# Altium schematic sheet MAZ000164 - Diagrama eléctrico.SchDoc: MAZ000164 - Diagrama eléctrico
size A; ApprovedBy: Christian Ledwidth; CheckedBy: Nahuel Martinez; Author: Santiago Marti; CompanyName: Body Health; DrawnBy: Santiago Marti; Revision: A; SheetNumber: 1; SheetTotal: 2
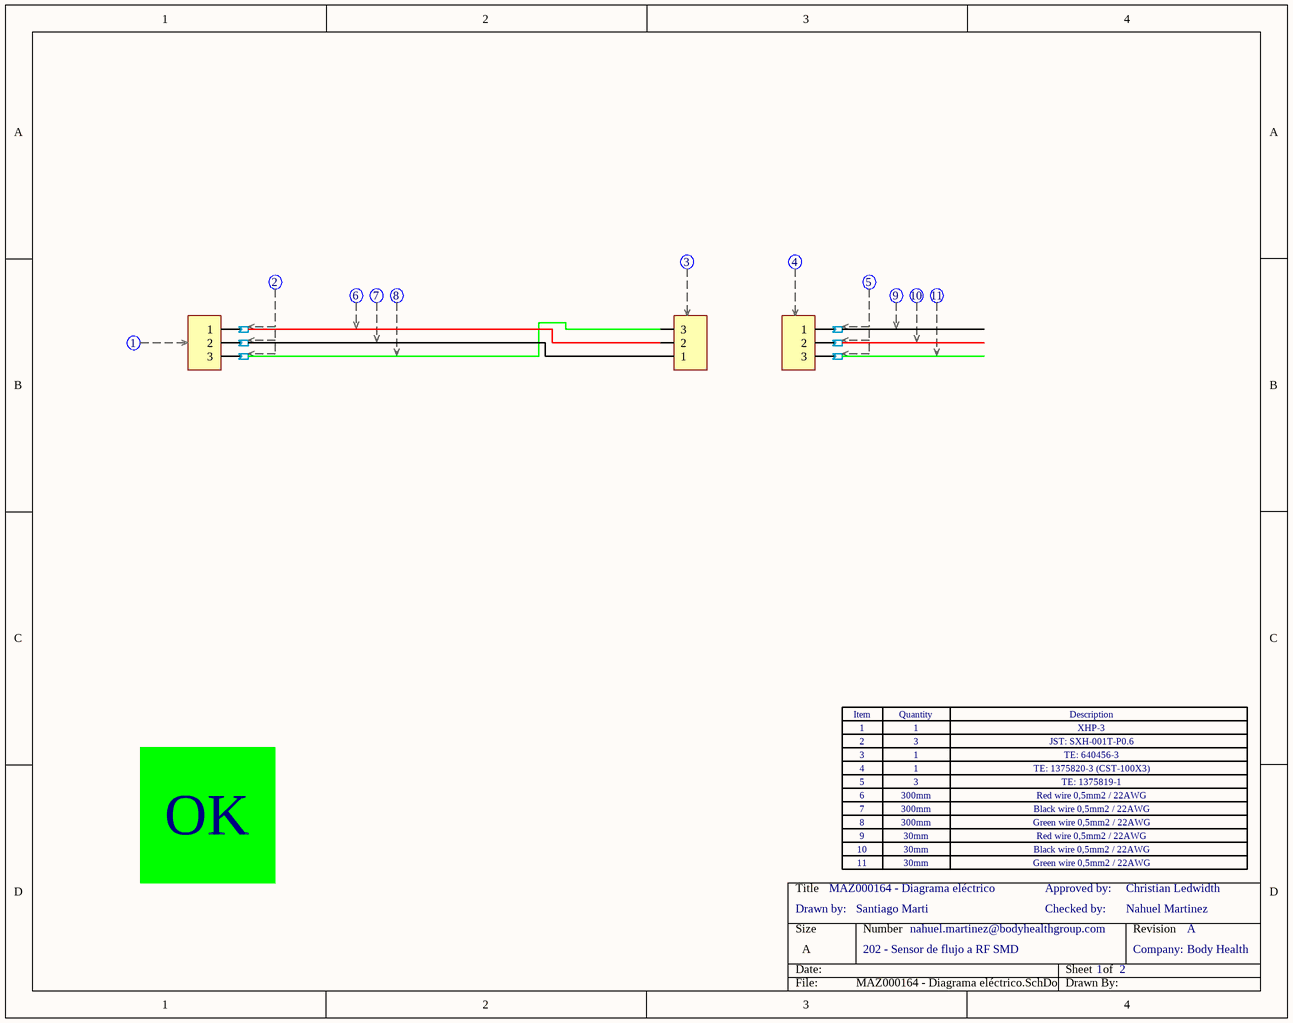
[diagram p0: MAZ000164 - Diagrama eléctrico.SchDoc]

## Parts
(Parts that share a designator on the sheet are numbered #1, #2 ... from top to bottom, then left to right.)
Con1  XHP-3  (value not drawn)  (parts C,D of 4)
Con?#1  XHP-3  (value not drawn)  (part C of 4)
Con?#2  XHP-3  (value not drawn)  (part C of 4)
Con?#3  CST-100-3  (value not drawn)  (part D of 4)
Con?#4  CST-100-3  (value not drawn)  (part D of 4)
Soc1  sock_XHP_SXH-002T-P0.6  (value not drawn)  (parts A,B of 2)
Soc2  sock_XHP_SXH-002T-P0.6  (value not drawn)  (parts A,B of 2)
Soc3  sock_XHP_SXH-002T-P0.6  (value not drawn)  (parts A,B of 2)
Soc4  sock_XHP_SXH-002T-P0.6  (value not drawn)  (part A of 2)
Soc?#1  sock_XHP_SXH-002T-P0.6  (value not drawn)  (part A of 2)
Soc?#2  sock_XHP_SXH-002T-P0.6  (value not drawn)  (part A of 2)
Soc?#3  sock_XHP_SXH-002T-P0.6  (value not drawn)  (part A of 2)
Soc?#4  sock_XHP_SXH-002T-P0.6  (value not drawn)  (part A of 2)
Soc?#5  sock_XHP_SXH-002T-P0.6  (value not drawn)  (part B of 2)
Soc?#6  sock_XHP_SXH-002T-P0.6  (value not drawn)  (part B of 2)
Soc?#7  sock_XHP_SXH-002T-P0.6  (value not drawn)  (part B of 2)
Zoc1  Zócalo_Header  (value not drawn)
Zoc2  Zócalo_Item  (value not drawn)
Zoc3  Zócalo_Item  (value not drawn)
Zoc4  Zócalo_Item  (value not drawn)
Zoc5  Zócalo_Item  (value not drawn)
Zoc6  Zócalo_Item  (value not drawn)
Zoc?#1  Zócalo_Item  (value not drawn)
Zoc?#2  Zócalo_Item  (value not drawn)
Zoc?#3  Zócalo_Item  (value not drawn)
Zoc?#4  Zócalo_Item  (value not drawn)
Zoc?#5  Zócalo_Item  (value not drawn)
Zoc?#6  Zócalo_Item  (value not drawn)

## Nets
NetCon1_1: Con1.1 Soc1.0
NetCon1_2: Con1.2 Soc2.0
NetCon1_3: Con1.3 Soc3.0
NetCon?#3_1: Con?#3.1 Soc2.1
NetCon?#3_2: Con?#3.2 Soc1.1
NetCon?#3_3: Con?#3.3 Soc3.1
NetCon?#4_1: Con?#4.1 Soc?#5.0
NetCon?#4_2: Con?#4.2 Soc?#6.0
NetCon?#4_3: Con?#4.3 Soc?#7.0

Not connected (* = marked no-connect by the designer): Soc?#5 1; Soc?#6 1; Soc?#7 1

## Notes on the sheet
- 1
- 2
- 3
- (near Zoc?#1) 4
- (near Zoc?#2) 5
- XHP-3
- JST: SXH-001T-P0.6
- TE: 640456-3
- TE: 1375820-3 (CST-100X3)
- TE: 1375819-1
- OK
- 6
- 7
- 8
- 9
- 300mm
- 30mm
- Red wire 0,5mm2 / 22AWG
- Black wire 0,5mm2 / 22AWG
- Green wire 0,5mm2 / 22AWG
- (near Zoc?#6) Drawn by:
- (near Zoc?#4) 10
- (near Zoc?#5) 11
- Checked by:
- Approved by:
- 202 - Sensor de flujo a RF SMD
- nahuel.martinez@bodyhealthgroup.com
- Company:
- (in symbol Zócalo_Header) Item; Quantity; Description

## Library data of the parts
Con1 = XHP-3: CONN HOUSING 2.5MM 3POS; Fabricante: JST Sales America Inc.; CallOut: 1; Cod.DigiKey: 455-2219-ND; Cod.Fabricante: XHP-3; ComponentLink1Description: Manufacturer Link; ComponentLink1URL: http://www.jst-mfg.com/product/pdf/eng/eXH.pdf; DIGIKEYx50: 0.06220; DIGIKEYx100: NO
Con?#1 = XHP-3: CONN HOUSING 2.5MM 3POS; Fabricante: JST Sales America Inc.; CallOut: 3; Cod.DigiKey: 455-2219-ND; Cod.Fabricante: XHP-3; ComponentLink1Description: Manufacturer Link; ComponentLink1URL: http://www.jst-mfg.com/product/pdf/eng/eXH.pdf; DIGIKEYx50: 0.06220; DIGIKEYx100: NO
Con?#2 = XHP-3: CONN HOUSING 2.5MM 3POS; Fabricante: JST Sales America Inc.; CallOut: 4; Cod.DigiKey: 455-2219-ND; Cod.Fabricante: XHP-3; ComponentLink1Description: Manufacturer Link; ComponentLink1URL: http://www.jst-mfg.com/product/pdf/eng/eXH.pdf; DIGIKEYx50: 0.06220; DIGIKEYx100: NO
Con?#3 Con?#4 = CST-100-3: CONN RCPT HSNG 3POS CST-100 II; Cod.Fabricante: 1375820-3; Fabricante: TE Connectivity AMP Connectors; Cod.DigiKey: A99614-ND; ComponentLink1Description: Manufacturer Link; ComponentLink1URL: https://www.te.com/commerce/DocumentDelivery/DDEController?Action=srchrtrv&DocNm=1375820&DocType=Customer+Drawing&DocLang=English; DIGIKEYx50: 0.12620; CallOut: *; DIGIKEYx100: 0.11720
Soc1 = sock_XHP_SXH-002T-P0.6: CONN SOCKET 26-30AWG CRIMP TIN; Fabricante: JST Sales America Inc.; CallOut: 2; Cod.DigiKey: 455-2261-1-ND; Cod.Fabricante: SXH-002T-P0.6; ComponentLink1Description: Manufacturer Link; ComponentLink1URL: http://www.jst-mfg.com/product/pdf/eng/eXH.pdf; DIGIKEYx100: 0.03300; DIGIKEYx50: 0.03420
Soc2 = sock_XHP_SXH-002T-P0.6: CONN SOCKET 26-30AWG CRIMP TIN; Fabricante: JST Sales America Inc.; CallOut: 6; Cod.DigiKey: 455-2261-1-ND; Cod.Fabricante: SXH-002T-P0.6; ComponentLink1Description: Manufacturer Link; ComponentLink1URL: http://www.jst-mfg.com/product/pdf/eng/eXH.pdf; DIGIKEYx100: 0.03300; DIGIKEYx50: 0.03420
Soc3 = sock_XHP_SXH-002T-P0.6: CONN SOCKET 26-30AWG CRIMP TIN; Fabricante: JST Sales America Inc.; CallOut: 7; Cod.DigiKey: 455-2261-1-ND; Cod.Fabricante: SXH-002T-P0.6; ComponentLink1Description: Manufacturer Link; ComponentLink1URL: http://www.jst-mfg.com/product/pdf/eng/eXH.pdf; DIGIKEYx100: 0.03300; DIGIKEYx50: 0.03420
Soc4 = sock_XHP_SXH-002T-P0.6: CONN SOCKET 26-30AWG CRIMP TIN; Fabricante: JST Sales America Inc.; CallOut: 8; Cod.DigiKey: 455-2261-1-ND; Cod.Fabricante: SXH-002T-P0.6; ComponentLink1Description: Manufacturer Link; ComponentLink1URL: http://www.jst-mfg.com/product/pdf/eng/eXH.pdf; DIGIKEYx100: 0.03300; DIGIKEYx50: 0.03420
Soc?#1 = sock_XHP_SXH-002T-P0.6: CONN SOCKET 26-30AWG CRIMP TIN; Fabricante: JST Sales America Inc.; CallOut: 5; Cod.DigiKey: 455-2261-1-ND; Cod.Fabricante: SXH-002T-P0.6; ComponentLink1Description: Manufacturer Link; ComponentLink1URL: http://www.jst-mfg.com/product/pdf/eng/eXH.pdf; DIGIKEYx100: 0.03300; DIGIKEYx50: 0.03420
Soc?#2 = sock_XHP_SXH-002T-P0.6: CONN SOCKET 26-30AWG CRIMP TIN; Fabricante: JST Sales America Inc.; CallOut: 9; Cod.DigiKey: 455-2261-1-ND; Cod.Fabricante: SXH-002T-P0.6; ComponentLink1Description: Manufacturer Link; ComponentLink1URL: http://www.jst-mfg.com/product/pdf/eng/eXH.pdf; DIGIKEYx100: 0.03300; DIGIKEYx50: 0.03420
Soc?#3 = sock_XHP_SXH-002T-P0.6: CONN SOCKET 26-30AWG CRIMP TIN; Fabricante: JST Sales America Inc.; CallOut: 10; Cod.DigiKey: 455-2261-1-ND; Cod.Fabricante: SXH-002T-P0.6; ComponentLink1Description: Manufacturer Link; ComponentLink1URL: http://www.jst-mfg.com/product/pdf/eng/eXH.pdf; DIGIKEYx100: 0.03300; DIGIKEYx50: 0.03420
Soc?#4 = sock_XHP_SXH-002T-P0.6: CONN SOCKET 26-30AWG CRIMP TIN; Fabricante: JST Sales America Inc.; CallOut: 11; Cod.DigiKey: 455-2261-1-ND; Cod.Fabricante: SXH-002T-P0.6; ComponentLink1Description: Manufacturer Link; ComponentLink1URL: http://www.jst-mfg.com/product/pdf/eng/eXH.pdf; DIGIKEYx100: 0.03300; DIGIKEYx50: 0.03420
Soc?#5-Soc?#7 = sock_XHP_SXH-002T-P0.6: CONN SOCKET 26-30AWG CRIMP TIN; Fabricante: JST Sales America Inc.; Cod.DigiKey: 455-2261-1-ND; Cod.Fabricante: SXH-002T-P0.6; ComponentLink1Description: Manufacturer Link; ComponentLink1URL: http://www.jst-mfg.com/product/pdf/eng/eXH.pdf; DIGIKEYx100: 0.03300; CallOut: *; DIGIKEYx50: 0.03420
Zoc1 = Zócalo_Header: Header para el zócalo de referencias
Zoc2-Zoc6 Zoc?#1-Zoc?#6 = Zócalo_Item: Ítem para el zócalo de referencias; Desginator: *; Quantity: *; ItemDescription: *